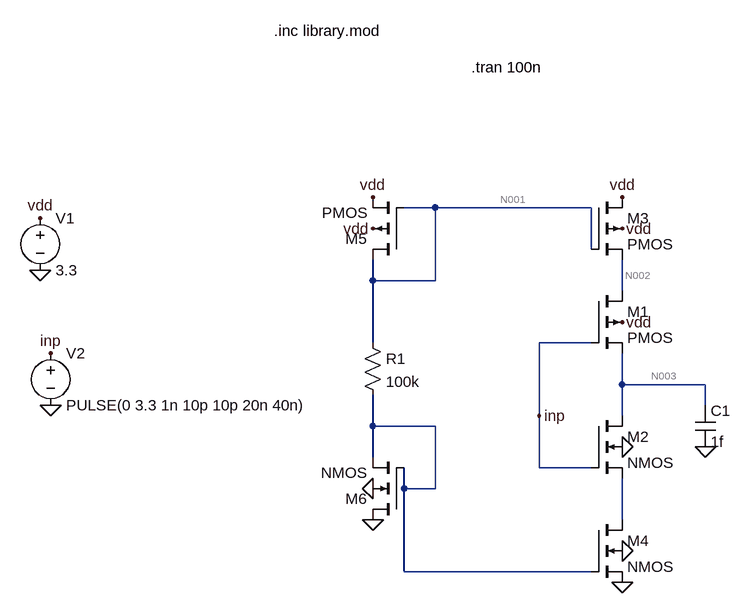
[diagram p0: schematic Draft10.asc]
Draft10.asc, the LTspice schematic file:
Version 4
SHEET 1 1368 1028
WIRE 112 144 64 144
WIRE 352 144 112 144
WIRE 352 208 352 144
WIRE 16 256 16 224
WIRE 112 256 112 144
WIRE 112 256 16 256
WIRE 400 272 400 224
WIRE 16 352 16 256
WIRE 352 352 272 352
WIRE 400 416 400 368
WIRE 528 416 400 416
WIRE 528 448 528 416
WIRE 272 464 272 352
WIRE 400 464 400 416
WIRE 16 480 16 432
WIRE 112 480 16 480
WIRE 16 528 16 480
WIRE 272 544 272 464
WIRE 352 544 272 544
WIRE 64 576 64 544
WIRE 112 576 112 480
WIRE 112 576 64 576
WIRE 400 624 400 560
WIRE 64 704 64 576
WIRE 352 704 64 704
FLAG -496 240 0
FLAG -496 160 vdd
FLAG -480 448 0
FLAG -480 368 inp
FLAG 272 464 inp
FLAG 400 128 vdd
FLAG 16 128 vdd
FLAG 16 176 vdd
FLAG 400 176 vdd
FLAG 400 320 vdd
FLAG 400 512 0
FLAG 400 720 0
FLAG 16 624 0
FLAG 16 576 0
FLAG 400 672 0
FLAG 528 512 0
SYMBOL voltage -496 144 R0
WINDOW 123 0 0 Left 0
WINDOW 39 0 0 Left 0
SYMATTR InstName V1
SYMATTR Value 3.3
SYMBOL voltage -480 352 R0
WINDOW 123 0 0 Left 0
WINDOW 39 0 0 Left 0
SYMATTR InstName V2
SYMATTR Value PULSE(0 3.3 1n 10p 10p 20n 40n)
SYMBOL pmos4 352 128 R0
SYMATTR InstName M3
SYMATTR Value2 l=0.6u w=0.6u
SYMBOL pmos4 352 272 R0
SYMATTR InstName M1
SYMATTR Value2 l=0.35u w=2.5u
SYMBOL pmos4 64 224 R180
SYMATTR InstName M5
SYMATTR Value2 l=0.6u w=0.6u
SYMBOL nmos4 352 464 R0
SYMATTR InstName M2
SYMATTR Value2 l=0.35u w=2.5u
SYMBOL nmos4 352 624 R0
SYMATTR InstName M4
SYMATTR Value2 l=0.6u w=0.6u
SYMBOL nmos4 64 624 R180
SYMATTR InstName M6
SYMATTR Value2 l=0.6u w=0.6u
SYMBOL res 0 336 R0
SYMATTR InstName R1
SYMATTR Value 100k
SYMBOL cap 512 448 R0
SYMATTR InstName C1
SYMATTR Value 1f
TEXT -136 -128 Left 2 !.inc library.mod
TEXT 168 -72 Left 2 !.tran 100n

The netlist it stands for:
* Draft10.asc
V1 vdd 0 3.3
V2 inp 0 PULSE(0 3.3 1n 10p 10p 20n 40n)
M3 vdd N001 N002 vdd PMOS l=0.6u w=0.6u
M1 N002 inp N003 vdd PMOS l=0.35u w=2.5u
M5 N001 N001 vdd vdd PMOS l=0.6u w=0.6u
M2 N003 inp N005 0 NMOS l=0.35u w=2.5u
M4 N005 N004 0 0 NMOS l=0.6u w=0.6u
M6 0 N004 N004 0 NMOS l=0.6u w=0.6u
R1 N001 N004 100k
C1 N003 0 1f
.model NMOS NMOS
.model PMOS PMOS
.lib standard.mos
.inc library.mod
.tran 100n
.backanno
.end

* Results of the author's LTspice run, read from the files saved beside the schematic
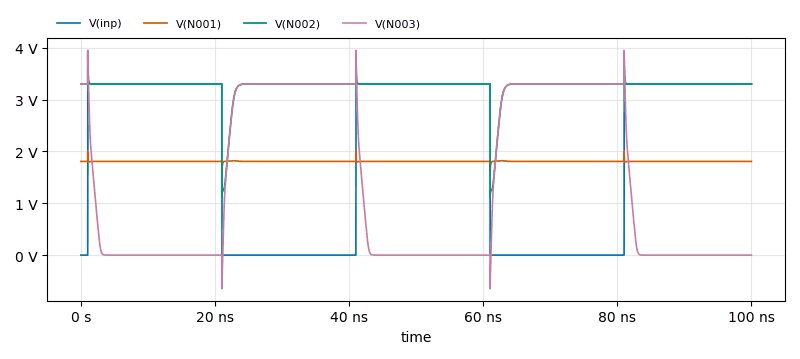
[diagram p1: Transient Analysis of Draft10.asc, plotted from the saved traces]
* Transient Analysis, 1 run:
*   V(inp): min 0 V, max 3.3 V, average 1.947 V, rms 2.535 V, last 3.3 V
*   V(N001): min 1.616 V, max 1.998 V, average 1.807 V, rms 1.807 V, last 1.807 V
*   V(N002): min 1.101 V, max 3.926 V, average 3.253 V, rms 3.264 V, last 3.3 V
*   V(N003): min -649.7 mV, max 3.948 V, average 1.381 V, rms 2.094 V, last 0 V